# EAGLE design RGB_HDMI (EAGLE 6.6.0)
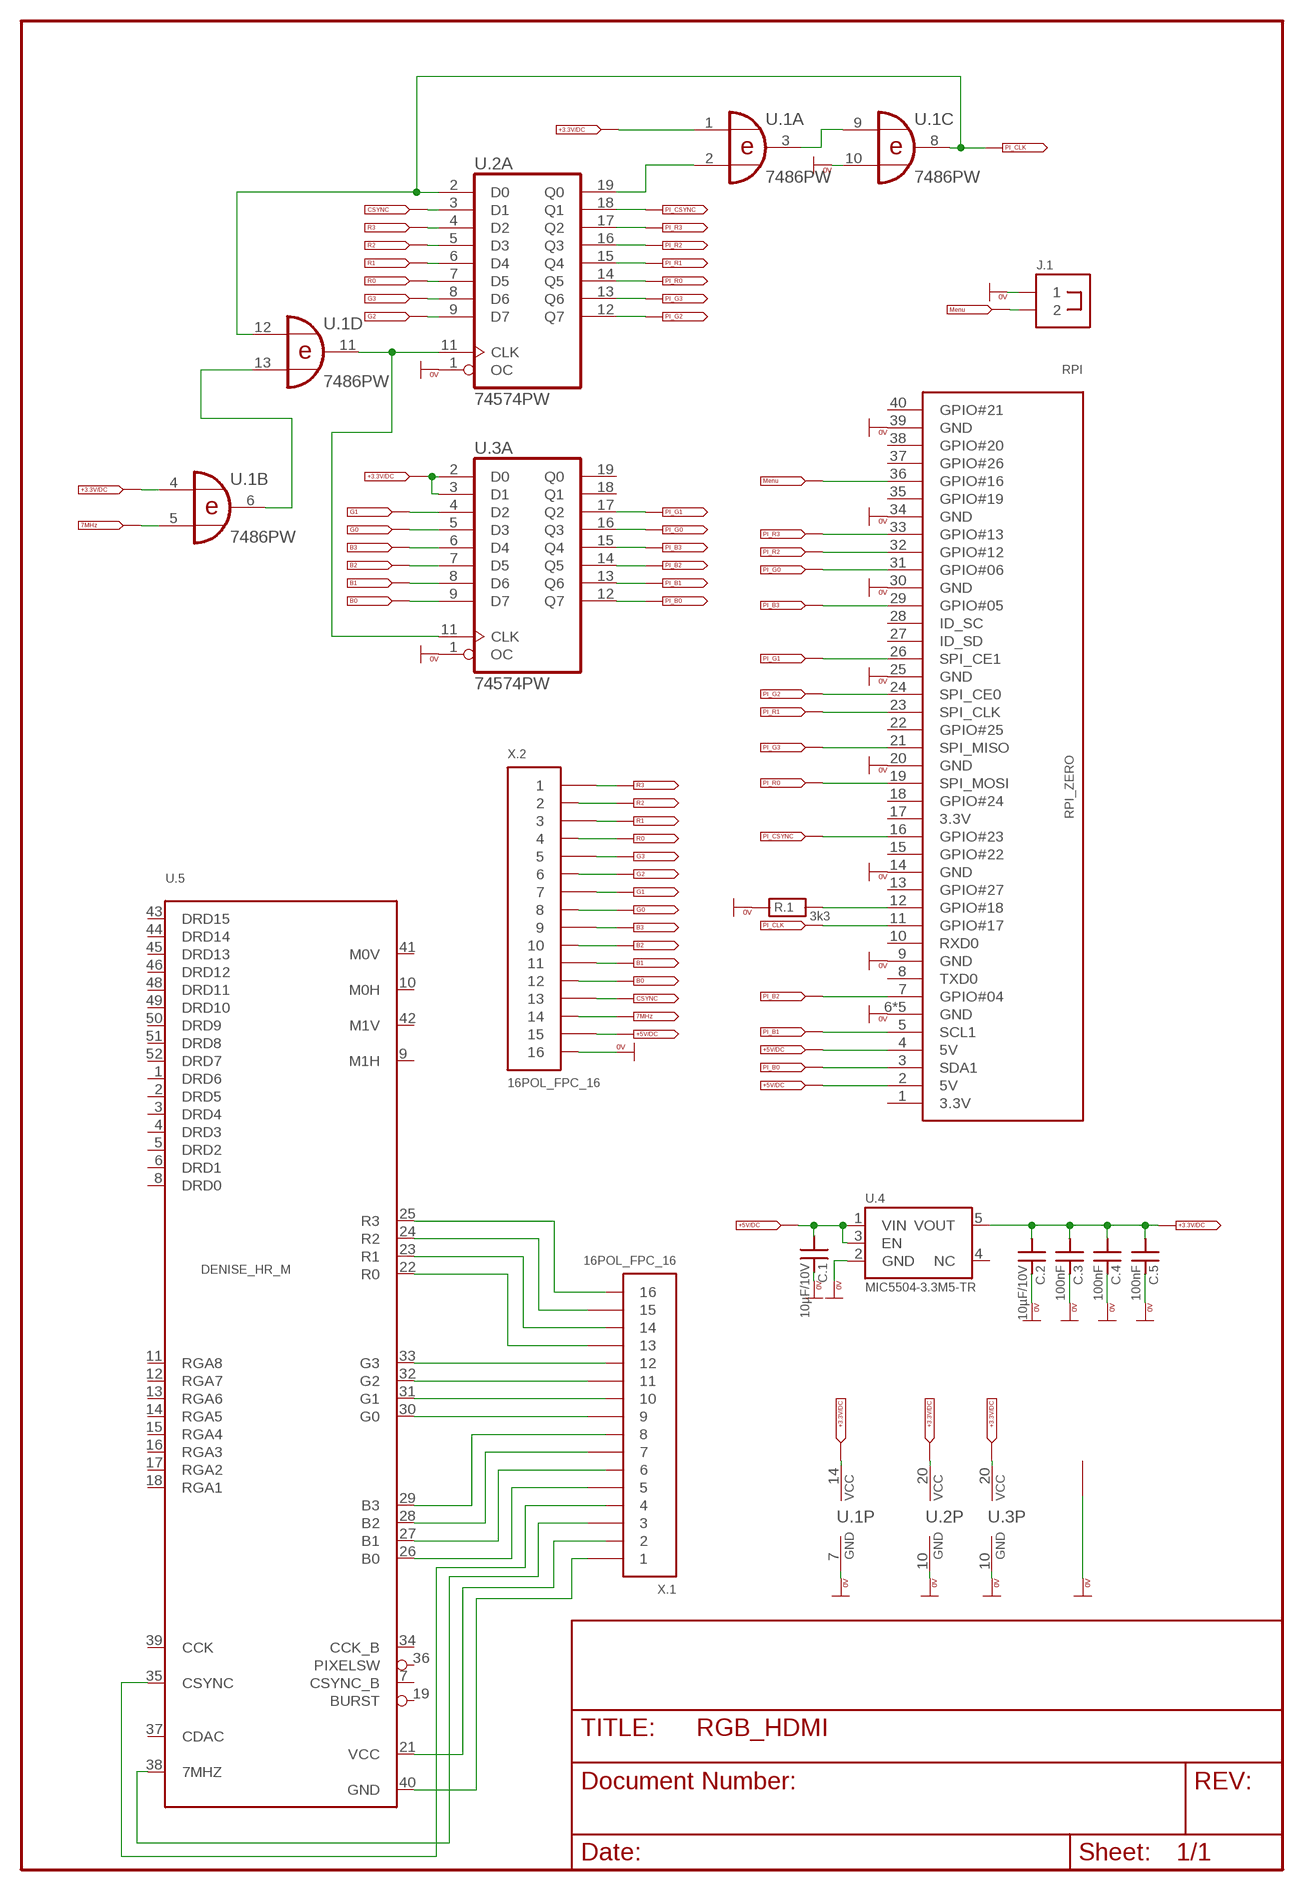
[diagram p0: schematic, sheet 1]

## Parts
C.1  10µF/10V  CAPACITOR_SMD_0805  [0805]
C.2  10µF/10V  CAPACITOR_SMD_0805  [0805]
C.3  100nF  CAPACITOR_SMD_0805  [0805]
C.4  100nF  CAPACITOR_SMD_0805  [0805]
C.5  100nF  CAPACITOR_SMD_0805  [0805]
J.1  2POLIG_1REIHIG  [2POLIG_1REIHIG]
K.1  PAD_1,0SQ  [1,0SQ]
R.1  3k3  RESISTOR_SMD_0805  [0805]
RPI  RPI_ZERO  [RPI_ZERO_FULL]
U.1  7486PW  [TSSOP14]
U.2  74574PW  [TSSOP20]
U.3  74574PW  [TSSOP20]
U.4  MIC5504-3.3M5-TR  TLV755P  [SOT23-5]
U.5  DENISE_HR_M  [PLCC_52_MIRROR]
X.1  16POL_FPC_16  [MOLEX_FPC_16]
X.2  16POL_FPC_16  [MOLEX_FPC_16]

## Nets
0V: C.1.2 C.2.2 C.3.2 C.4.2 C.5.2 J.1.1 K.1.P$1 R.1.1 RPI.6(GND) RPI.9(GND) RPI.14(GND) RPI.20(GND) RPI.25(GND) RPI.30(GND) RPI.34(GND) RPI.39(GND) RPI.P$1(GND) RPI.P$2(GND) RPI.P$3(GND) RPI.P$4(GND) U.1.7(P:GND) U.1.10(C:I1) U.2.1(A:OC) U.2.10(P:GND) U.3.1(A:OC) U.3.10(P:GND) U.4.2(GND) X.2.16
7MHZ: U.1.5(B:I1) X.2.14 ; supply symbol labelled 7MHz
+3.3V: C.2.1 C.3.1 C.4.1 C.5.1 U.1.1(A:I0) U.1.4(B:I0) U.1.14(P:VCC) U.2.20(P:VCC) U.3.2(A:D0) U.3.3(A:D1) U.3.20(P:VCC) U.4.5(VOUT) ; supply symbol labelled +3.3V-IN, +3.3V-OUT
+5V: C.1.1 RPI.2(5V) RPI.4(5V) U.4.1(VIN) U.4.3(EN) X.2.15 ; supply symbol labelled +5V-IN, +5V-OUT
B0: U.3.9(A:D7) X.2.12
B1: U.3.8(A:D6) X.2.11
B2: U.3.7(A:D5) X.2.10
B3: U.3.6(A:D4) X.2.9
CSYNC: U.2.3(A:D1) X.2.13
G0: U.3.5(A:D3) X.2.8
G1: U.3.4(A:D2) X.2.7
G2: U.2.9(A:D7) X.2.6
G3: U.2.8(A:D6) X.2.5
GND: U.5.40(GND) X.1.1
MENUE: J.1.2 RPI.36(GPIO#16) ; supply symbol labelled Menu
N$1: U.1.6(B:O) U.1.13(D:I1)
N$2: U.5.25(R3) X.1.16
N$3: U.5.24(R2) X.1.15
N$4: U.5.23(R1) X.1.14
N$5: U.5.22(R0) X.1.13
N$6: U.1.11(D:O) U.2.11(A:CLK) U.3.11(A:CLK)
N$7: U.1.2(A:I1) U.2.19(A:Q0)
N$8: U.1.3(A:O) U.1.9(C:I0)
N$9: U.5.30(G0) X.1.9
N$10: U.5.31(G1) X.1.10
N$11: U.5.32(G2) X.1.11
N$12: U.5.33(G3) X.1.12
N$13: U.5.29(B3) X.1.8
N$14: U.5.28(B2) X.1.7
N$15: U.5.27(B1) X.1.6
N$16: U.5.26(B0) X.1.5
N$18: U.5.21(VCC) X.1.2
N$19: U.5.38(7MHZ) X.1.3
N$20: U.5.35(CSYNC) X.1.4
N$37: R.1.2 RPI.12(GPIO#18)
PI_B0: RPI.3(SDA1) U.3.12(A:Q7)
PI_B1: RPI.5(SCL1) U.3.13(A:Q6)
PI_B2: RPI.7(GPIO#04) U.3.14(A:Q5)
PI_B3: RPI.29(GPIO#05) U.3.15(A:Q4)
PI_CLK: RPI.11(GPIO#17) U.1.8(C:O) U.1.12(D:I0) U.2.2(A:D0)
PI_CSYNC: RPI.16(GPIO#23) U.2.18(A:Q1)
PI_G0: RPI.31(GPIO#06) U.3.16(A:Q3)
PI_G1: RPI.26(SPI_CE1) U.3.17(A:Q2)
PI_G2: RPI.24(SPI_CE0) U.2.12(A:Q7)
PI_G3: RPI.21(SPI_MISO) U.2.13(A:Q6)
PI_R0: RPI.19(SPI_MOSI) U.2.14(A:Q5)
PI_R1: RPI.23(SPI_CLK) U.2.15(A:Q4)
PI_R2: RPI.32(GPIO#12) U.2.16(A:Q3)
PI_R3: RPI.33(GPIO#13) U.2.17(A:Q2)
R0: U.2.7(A:D5) X.2.4
R1: U.2.6(A:D4) X.2.3
R2: U.2.5(A:D3) X.2.2
R3: U.2.4(A:D2) X.2.1
Unconnected: RPI.1(3.3V) RPI.8(TXD0) RPI.10(RXD0) RPI.13(GPIO#27) RPI.15(GPIO#22) RPI.17(3.3V) RPI.18(GPIO#24) RPI.22(GPIO#25) RPI.27(ID_SD) RPI.28(ID_SC) RPI.35(GPIO#19) RPI.37(GPIO#26) RPI.38(GPIO#20) RPI.40(GPIO#21) U.3.18(A:Q1) U.3.19(A:Q0) U.4.4(NC) U.5.1(DRD6) U.5.2(DRD5) U.5.3(DRD4) U.5.4(DRD3) U.5.5(DRD2) U.5.6(DRD1) U.5.7(CSYNC_B) U.5.8(DRD0) U.5.9(M1H) U.5.10(M0H) U.5.11(RGA8) U.5.12(RGA7) U.5.13(RGA6) U.5.14(RGA5) U.5.15(RGA4) U.5.16(RGA3) U.5.17(RGA2) U.5.18(RGA1) U.5.19(BURST) U.5.34(CCK_B) U.5.36(PIXELSW) U.5.37(CDAC) U.5.39(CCK) U.5.41(M0V) U.5.42(M1V) U.5.43(DRD15) U.5.44(DRD14) U.5.45(DRD13) U.5.46(DRD12) U.5.48(DRD11) U.5.49(DRD10) U.5.50(DRD9) U.5.51(DRD8) U.5.52(DRD7)

## Library data of the parts
C.1-C.5 = de_discrete:CAPACITOR
J.1 = de_jumper:2POLIG
K.1 = de_loetauge:PAD
R.1 = de_discrete:RESISTOR
RPI = de_controller:RPI_ZERO
U.1 = de_logic:74*86: Quad 2-input EXCLUSIVE-OR (XOR) gate
U.2 U.3 = de_logic:74*574: 8-bit D type FLIP FLOP bus driver
U.4 = de_power:TLV755P
U.5 = Amiga:DENISE_HR
X.1 X.2 = de_connectors:16POL

## Board
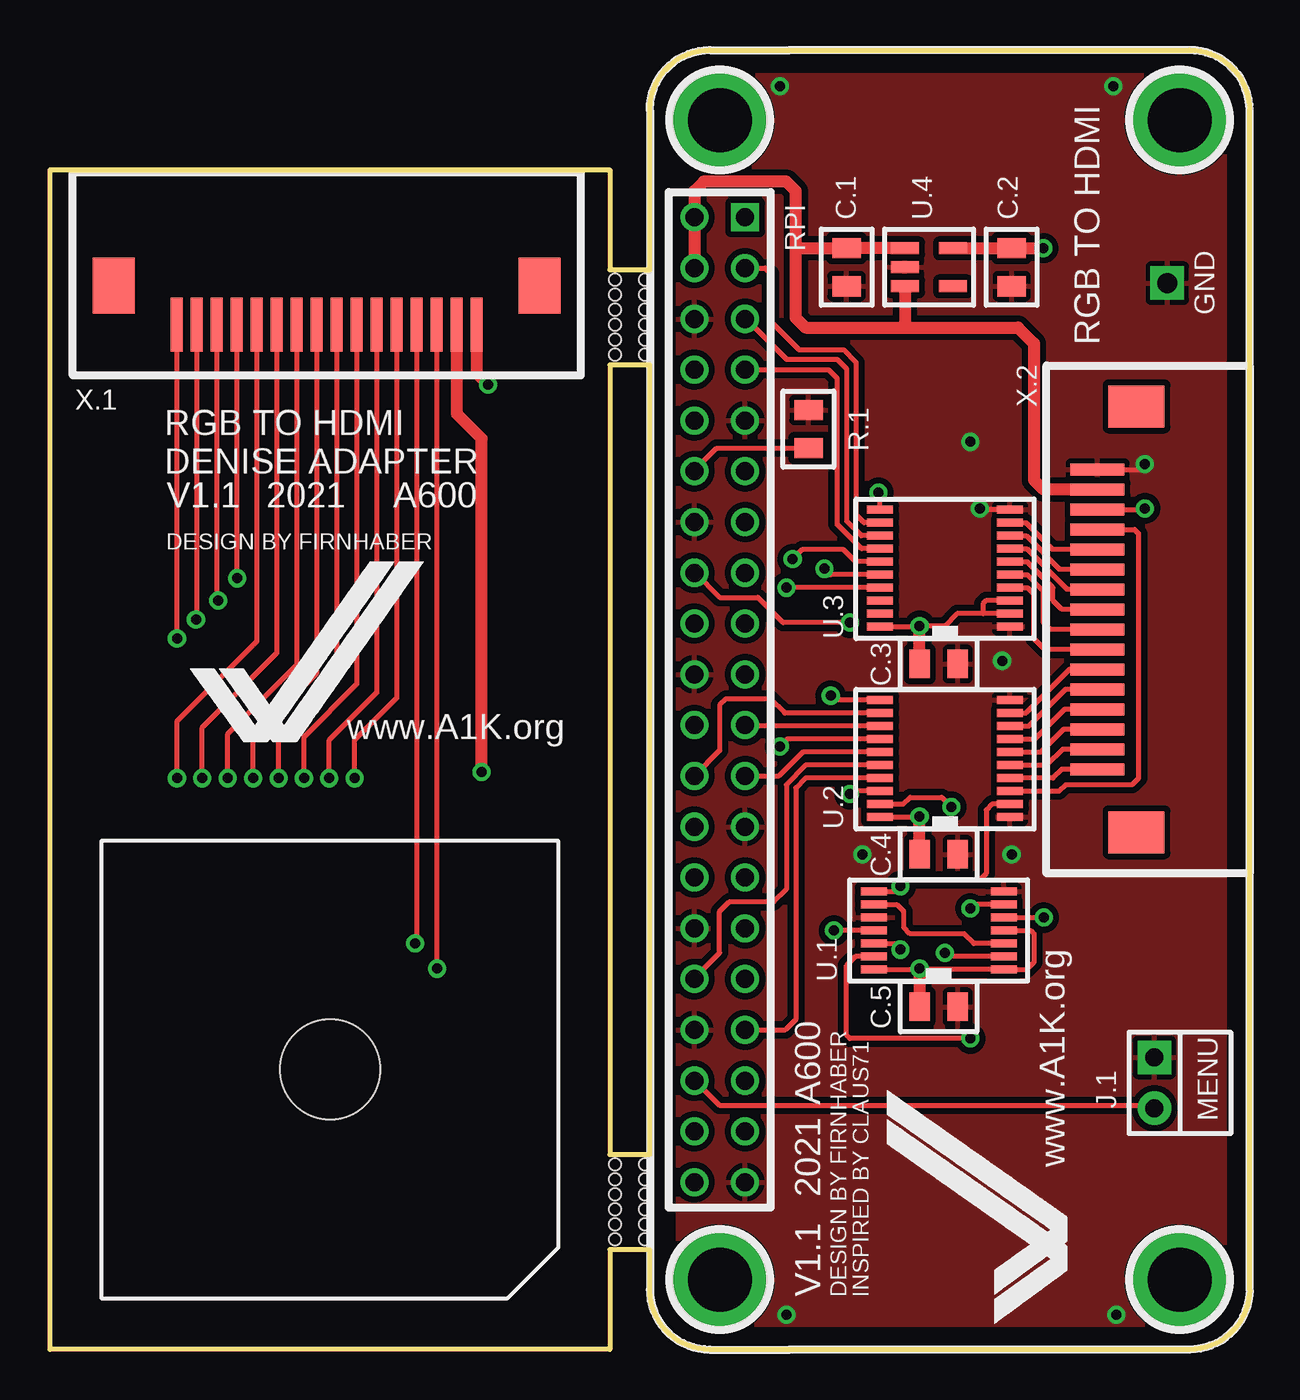
[diagram p1: board, top side]
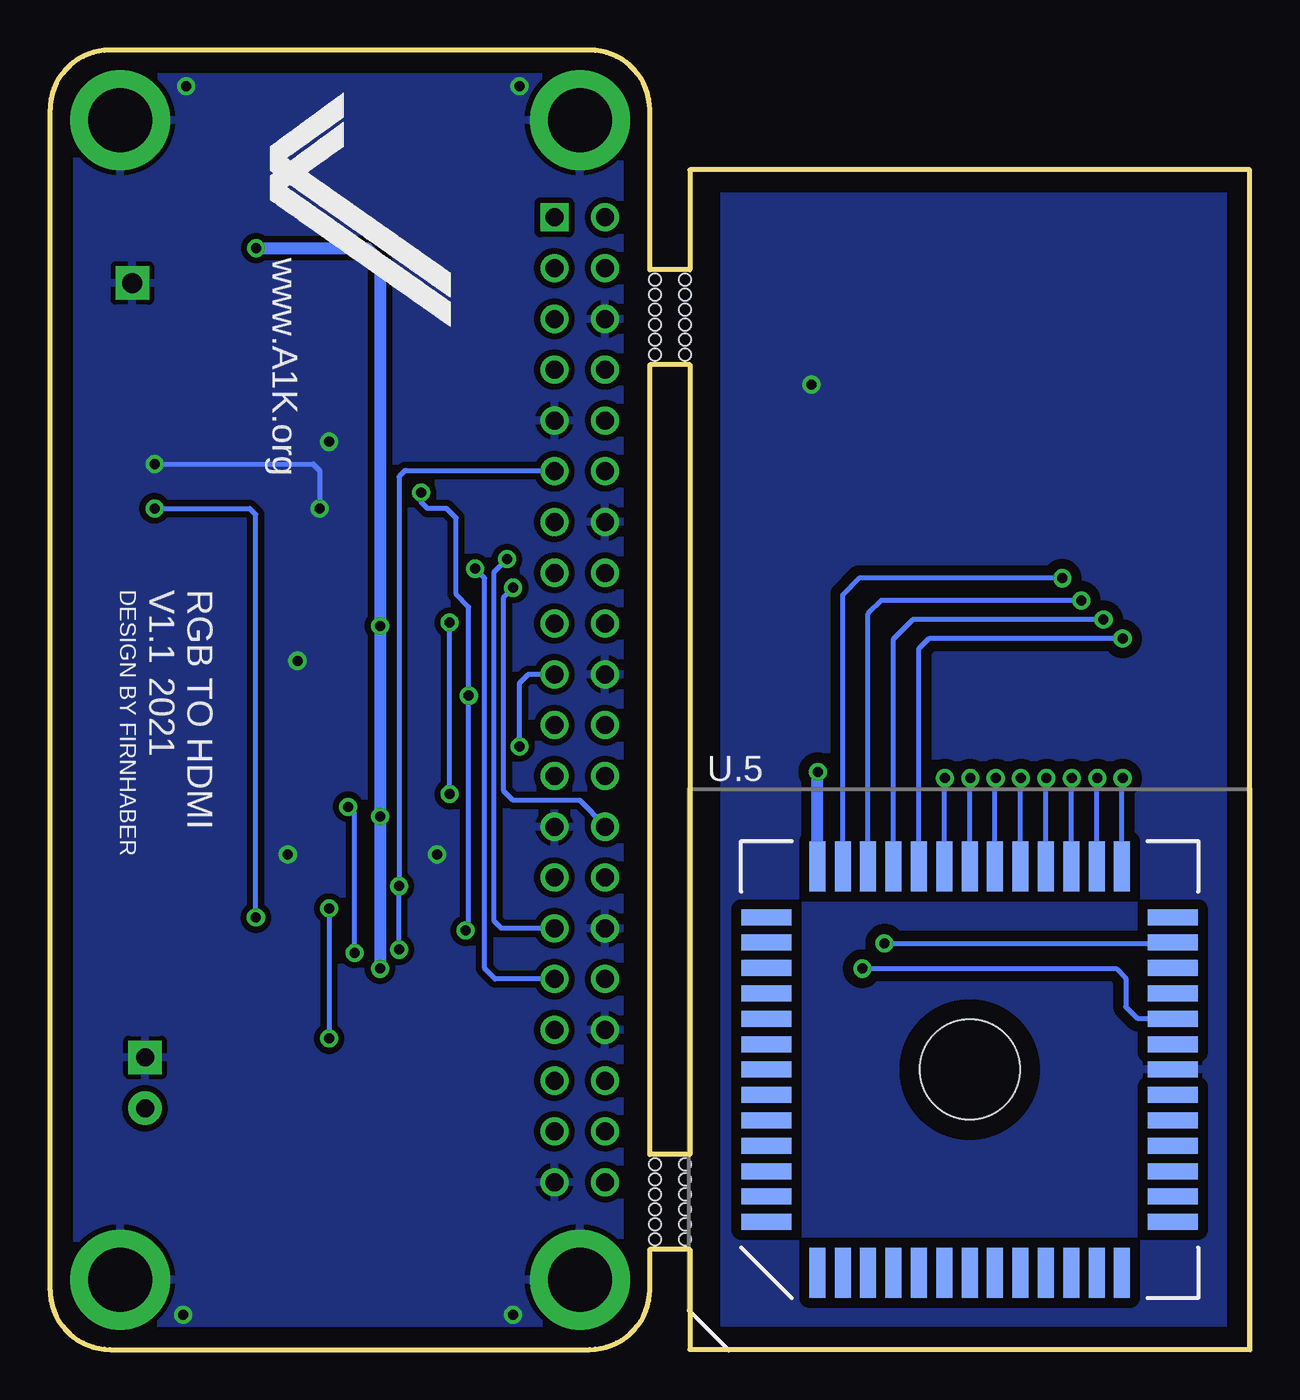
[diagram p2: board, bottom side, seen from below]

Size 60 x 65 mm. Coordinates in mm from the lower left corner, seen from the top.
Outline: 60,3 arc-90 57,0 33,0 arc-90 30,3
Outline: 30,62 arc-90 33,65 57,65 arc-90 60,62
Outline: 60,3 60,62
Outline: 30,3 30,5 28,5 28,0 0,0 0,59 28,59 28,54 30,54 30,62
Outline: 28,49.25 28,9.75 30,9.75 30,49.25 28,49.25
Copper layers (1*16): Top 0.035mm / dielectric 1.5mm / Bottom 0.035mm
Design rules "default *": minimum track width 10mil, minimum drill 24mil, track to track 5mil, track to pad 5mil, pad to pad 5mil, via to via 5mil, smd to smd 5mil, copper to edge 40mil, drill to drill 8mil, minimum pad ring 10mil, minimum via ring 8mil, stop-mask expansion 4mil, vias tented up to drill 30mil, thermal gap 10mil
Holes 5 mm at 14,14
Holes 0.6 mm at 28.25,53.5 28.25,52.75 28.25,52 28.25,51.25 28.25,50.5 28.25,49.75 29.75,53.5 29.75,52.75 29.75,52 29.75,51.25 29.75,50.5 29.75,49.75 28.25,5.5 28.25,6.25 28.25,7 28.25,7.75 28.25,8.5 28.25,9.25 29.75,9.25 29.75,8.5 29.75,7.75 29.75,7 29.75,6.25 29.75,5.5
tRestrict: area 28.5,0 to 31,64
bRestrict: area 27,0 to 29.5,59; area 28.5,0 to 31,64

### Footprints (pad centres in the part's own frame; a part is rotated, then mirrored left to right if it is on the bottom)
0805 = smd 1.016 x 1.422: 1 -0.953,0; 2 0.953,0
2POLIG_1REIHIG = drill 0.9 pad 1.676 square: 1 -1.27,0 | drill 0.9 pad 1.676: 2 1.27,0
1,0SQ = drill 1 pad 1.676 square: P$1 0,0
RPI_ZERO_FULL = drill 0.9 square: 1 2.23,8.37 | drill 0.9: 2 4.77,8.37; 3 2.23,10.91; 4 4.77,10.91; 5 2.23,13.45; 6 4.77,13.45; 7 2.23,15.99; 8 4.77,15.99; 9 2.23,18.53; 10 4.77,18.53; 11 2.23,21.07; 12 4.77,21.07; 13 2.23,23.61; 14 4.77,23.61; 15 2.23,26.15; 16 4.77,26.15; 17 2.23,28.69; 18 4.77,28.69; 19 2.23,31.23; 20 4.77,31.23; 21 2.23,33.77; 22 4.77,33.77; 23 2.23,36.31; 24 4.77,36.31; 25 2.23,38.85; 26 4.77,38.85; 27 2.23,41.39; 28 4.77,41.39; 29 2.23,43.93; 30 4.77,43.93; 31 2.23,46.47; 32 4.77,46.47; 33 2.23,49.01; 34 4.77,49.01; 35 2.23,51.55; 36 4.77,51.55; 37 2.23,54.09; 38 4.77,54.09; 39 2.23,56.63; 40 4.77,56.63 | drill 3.2 pad 5: P$1 -19.5,61.5; P$2 3.5,61.5; P$3 -19.5,3.5; P$4 3.5,3.5
TSSOP14 = smd 0.4 x 1.3: 1 -1.95,-3.25; 2 -1.3,-3.25; 3 -0.65,-3.25; 4 0,-3.25; 5 0.65,-3.25; 6 1.3,-3.25; 7 1.95,-3.25; 8 1.95,3.25; 9 1.3,3.25; 10 0.65,3.25; 11 0,3.25; 12 -0.65,3.25; 13 -1.3,3.25; 14 -1.95,3.25
TSSOP20 = smd 0.4 x 1.3: 1 -2.902,-3.25; 2 -2.252,-3.25; 3 -1.603,-3.25; 4 -0.953,-3.25; 5 -0.302,-3.25; 6 0.347,-3.25; 7 0.998,-3.25; 8 1.647,-3.25; 9 2.297,-3.25; 10 2.947,-3.25; 11 2.947,3.25; 12 2.297,3.25; 13 1.647,3.25; 14 0.998,3.25; 15 0.347,3.25; 16 -0.302,3.25; 17 -0.953,3.25; 18 -1.603,3.25; 19 -2.252,3.25; 20 -2.902,3.25
SOT23-5 = smd 0.6 x 1.4: 1 -0.95,-1.2; 2 -0.003,-1.2; 3 0.95,-1.2; 4 0.953,1.2; 5 -0.953,1.2
PLCC_52_MIRROR = smd 2.5 x 0.8: 1 10.16,0; 2 10.16,-1.27; 3 10.16,-2.54; 4 10.16,-3.81; 5 10.16,-5.08; 6 10.16,-6.35; 7 10.16,-7.62; 21 -10.16,-7.62; 22 -10.16,-6.35; 23 -10.16,-5.08; 24 -10.16,-3.81; 25 -10.16,-2.54; 26 -10.16,-1.27; 27 -10.16,0; 28 -10.16,1.27; 29 -10.16,2.54; 30 -10.16,3.81; 31 -10.16,5.08; 32 -10.16,6.35; 33 -10.16,7.62; 47 10.16,7.62; 48 10.16,6.35; 49 10.16,5.08; 50 10.16,3.81; 51 10.16,2.54; 52 10.16,1.27 | smd 0.8 x 2.5: 8 7.62,-10.16; 9 6.35,-10.16; 10 5.08,-10.16; 11 3.81,-10.16; 12 2.54,-10.16; 13 1.27,-10.16; 14 0,-10.16; 15 -1.27,-10.16; 16 -2.54,-10.16; 17 -3.81,-10.16; 18 -5.08,-10.16; 19 -6.35,-10.16; 20 -7.62,-10.16; 34 -7.62,10.16; 35 -6.35,10.16; 36 -5.08,10.16; 37 -3.81,10.16; 38 -2.54,10.16; 39 -1.27,10.16; 40 0,10.16; 41 1.27,10.16; 42 2.54,10.16; 43 3.81,10.16; 44 5.08,10.16; 45 6.35,10.16; 46 7.62,10.16
MOLEX_FPC_16 = smd 0.6 x 2.7: 1 -7.5,0; 2 -6.5,0; 3 -5.5,0; 4 -4.5,0; 5 -3.5,0; 6 -2.5,0; 7 -1.5,0; 8 -0.5,0; 9 0.5,0; 10 1.5,0; 11 2.5,0; 12 3.5,0; 13 4.5,0; 14 5.5,0; 15 6.5,0; 16 7.5,0 | smd 2.1 x 2.8: P$1 -10.65,-1.95; P$2 10.65,-1.95

### Placement (x,y rotation side)
C.1  39.85,54.13 270 top
C.2  48.1,54.13 270 top
C.3  44.45,34.29 0 top
C.4  44.45,24.77 0 top
C.5  44.45,17.15 0 top
J.1  55.24,13.34 270 top
K.1  55.88,53.34 0 top
R.1  37.94,46.04 270 top
RPI  37,65 180 top
U.1  44.45,20.96 90 top
U.2  44.77,29.53 90 top
U.3  44.77,39.05 90 top
U.4  43.97,54.13 270 top
U.5  14,14 270 bottom
X.1  13.84,51.26 180 top
X.2  52.39,36.51 90 top

### Tracks (layer width: path | path; a pad name or v marks a point on that pad's centre or on a via)
0V  (via drill 0.5)
  Top 0.254: X.2.16 54.49,44.01 v54.77,44.29 | U.3.10 46.58,42 v46.51,42.07 | 40.02,21.61 40.01,21.59
  Bottom 0.254: v54.77,44.29 46.83,44.29 46.51,43.97 v46.51,42.07
  other vias: 40.64,24.77 36.83,1.75 53.34,1.75 36.51,63.18 53.18,63.18 46.04,45.4 47.62,34.45 48.1,24.77
  pour Top (isolate 0.305): 30,0 30,65 60,65 60,0
  pour Bottom (isolate 0.305): 29.5,0 29.5,65 60,65 60,0
7MHZ  (via drill 0.5)
  Top 0.254: U.1.5 v49.7,21.61 | X.2.14 54.71,42.01 v54.77,42.07
  Bottom 0.254: v49.7,21.61 49.7,41.77 50.01,42.07 v54.77,42.07
+3.3V  (via drill 0.5)
  Top 0.254: U.2.20 43.45,26.63 v43.5,26.67 | U.1.14 43.45,19.01 v43.5,19.05 43.54,19.01 U.1.1 48.85,19.01 49.21,19.37 49.21,20.8 49.05,20.96 U.1.4 | U.3.2 46.67,36.8 | 46.67,36.8 45.37,36.8 44.77,36.2 v43.5,36.2 43.45,36.15 U.3.20 | U.3.3 46.82,37.45 46.67,37.31 46.67,36.8
  Top 0.61: U.4.5 C.2.1 v49.69,55.09 | v43.5,19.05 C.5.1 | C.4.1 v43.5,26.67 | C.3.1 v43.5,36.2
  Bottom 0.61: v49.69,55.09 44.13,55.09 43.5,54.45 v43.5,36.2 v43.5,26.67 v43.5,19.05
+5V
  Top 0.61: 37.31,55.09 37.31,51.59 37.78,51.12 42.86,51.12 | 37.31,55.09 C.1.1 U.4.1 | RPI.4 RPI.2 32.23,57.94 32.7,58.42 36.83,58.42 37.31,57.94 37.31,55.09 | 42.77,51.51 U.4.3 42.77,51.21 42.86,51.12 | 42.86,51.12 48.42,51.12 49.21,50.32 49.21,43.5 49.7,43.01 X.2.15
B0
  Top 0.254: U.3.9 48.82,41.35 50.16,40.01 X.2.12
B1
  Top 0.254: U.3.8 48.84,40.7 50.52,39.01 X.2.11
B2
  Top 0.254: U.3.7 48.85,40.05 50.89,38.01 X.2.10
B3
  Top 0.254: X.2.9 50.62,37.01 50.16,37.47 50.16,38.1 48.87,39.4 U.3.6
CSYNC
  Top 0.254: X.2.13 54.24,41.01 54.45,40.8 54.45,28.58 54.13,28.26 50.8,28.26 50.47,27.93 U.2.3
G0
  Top 0.254: X.2.8 50.03,36.01 49.69,36.35 49.69,37.94 48.88,38.75 U.3.5
G1
  Top 0.254: X.2.7 49.76,35.01 49.21,35.56 49.21,37.78 48.9,38.1 U.3.4
G2
  Top 0.254: U.2.9 48.81,31.83 51,34.01 X.2.6
G3
  Top 0.254: X.2.5 50.79,33.01 48.95,31.18 U.2.8
GND  (via drill 0.5)
  Top 0.61: X.1.1 21.34,48.83 v21.91,48.26
  pour Bottom (isolate 0.508): 0,0 0,59 28,59 28,0
MENUE
  Top 0.254: RPI.36 32.27,13.45 33.5,12.22 55.19,12.22 J.1.2
N$1  (via drill 0.5)
  Top 0.254: U.1.6 46.23,22.26 v46.04,22.07 | v46.04,15.56 40.01,15.56 39.85,15.72 39.85,19.21 40.29,19.66 U.1.13
  Bottom 0.254: v46.04,22.07 v46.04,15.56
N$2  (via drill 0.5)
  Top 0.254: X.1.16 6.34,35.87 v6.35,35.56
  Bottom 0.254: v6.35,35.56 16.03,35.56 16.54,35.05 U.5.25
N$3  (via drill 0.5)
  Top 0.254: X.1.15 7.34,36.55 v7.3,36.51
  Bottom 0.254: v7.3,36.51 16.83,36.51 17.81,35.53 U.5.24
N$4  (via drill 0.5)
  Top 0.254: X.1.14 8.34,37.54 v8.41,37.47
  Bottom 0.254: v8.41,37.47 18.41,37.47 19.08,36.8 U.5.23
N$5  (via drill 0.5)
  Top 0.254: X.1.13 9.34,38.6 v9.37,38.58
  Bottom 0.254: v9.37,38.58 19.53,38.58 20.35,37.75 U.5.22
N$6  (via drill 0.5)
  Top 0.254: U.1.11 v39.21,20.96 | U.2.11 39.28,32.48 v39.05,32.7 | U.3.11 41.52,42.78 v41.43,42.86
  Bottom 0.254: v39.21,20.96 39.05,21.11 v39.05,32.7 39.05,37.15 39.69,37.78 39.69,41.59 40.16,42.07 41.12,42.07 41.43,42.39 v41.43,42.86
N$7  (via drill 0.5)
  Top 0.254: U.1.2 44.96,19.66 v44.77,19.84 | U.2.19 42.67,27.28 43.02,27.62 44.61,27.62 v45.09,27.15
  Bottom 0.254: v44.77,19.84 44.77,26.83 v45.09,27.15
N$8
  Top 0.254: U.1.9 42.36,22.26 42.7,21.91 42.7,21.11 43.02,20.8 45.72,20.8 46.21,20.31 U.1.3
N$9  (via drill 0.5)
  Top 0.254: v10.16,28.58 10.16,30.64 13.34,33.82 X.1.9
  Bottom 0.254: U.5.30 10.19,28.55 v10.16,28.58
N$10  (via drill 0.5)
  Top 0.254: v8.89,28.58 8.89,30.8 12.34,34.25 X.1.10
  Bottom 0.254: U.5.31 8.92,28.55 v8.89,28.58
N$11  (via drill 0.5)
  Top 0.254: v7.62,28.58 7.62,31.12 11.34,34.84 X.1.11
  Bottom 0.254: U.5.32 7.65,28.55 v7.62,28.58
N$12  (via drill 0.5)
  Top 0.254: v6.35,28.58 6.35,31.43 10,35.08 10.16,35.24 10.34,35.42 X.1.12
  Bottom 0.254: U.5.33 6.38,28.55 v6.35,28.58
N$13  (via drill 0.5)
  Top 0.254: v11.43,28.58 11.43,30.64 14.34,33.55 X.1.8
  Bottom 0.254: U.5.29 11.46,28.55 v11.43,28.58
N$14  (via drill 0.5)
  Top 0.254: v12.7,28.58 12.7,30.64 15.34,33.28 X.1.7
  Bottom 0.254: U.5.28 12.73,28.55 v12.7,28.58
N$15  (via drill 0.5)
  Top 0.254: v13.97,28.58 13.97,30.48 16.34,32.85 X.1.6
  Bottom 0.254: U.5.27 14,28.55 v13.97,28.58
N$16  (via drill 0.5)
  Top 0.254: v15.24,28.58 15.24,30.48 17.34,32.58 X.1.5
  Bottom 0.254: U.5.26 15.27,28.55 v15.24,28.58
N$18  (via drill 0.5)
  Top 0.61: v21.59,28.89 21.59,45.56 20.34,46.81 X.1.2
  Bottom 0.61: U.5.21 21.62,28.86 v21.59,28.89
N$19  (via drill 0.5)
  Top 0.254: X.1.3 19.34,19.08 v19.37,19.05
  Bottom 0.254: v19.37,19.05 6.67,19.05 6.19,18.57 6.19,17.15 5.59,16.54 U.5.38
N$20  (via drill 0.5)
  Top 0.254: X.1.4 18.34,20.41 v18.26,20.32
  Bottom 0.254: v18.26,20.32 3.85,20.32 U.5.35
N$37
  Top 0.254: RPI.12 32.23,43.98 33.34,45.09 R.1.2
PI_B0
  Top 0.254: RPI.3 35.76,54.09 36.04,53.82 36.04,51.44 37.47,50.01 39.69,50.01 40.32,49.37 40.32,41.75 40.72,41.35 U.3.12
PI_B1
  Top 0.254: RPI.5 34.81,51.55 36.83,49.53 39.37,49.53 39.85,49.05 39.85,41.43 40.58,40.7 U.3.13
PI_B2
  Top 0.254: RPI.7 38.94,49.01 39.37,48.58 39.37,41.28 40.59,40.05 U.3.14
PI_B3  (via drill 0.5)
  Top 0.254: U.3.15 40.29,39.4 39.69,40.01 37.62,40.01 v37.15,39.53
  Bottom 0.254: RPI.29 37.42,21.07 37.78,21.43 37.78,38.89 v37.15,39.53
PI_CLK  (via drill 0.5)
  Top 0.254: U.2.2 47.12,27.28 46.83,26.99 46.83,23.81 46.51,23.5 42.86,23.5 v42.55,23.18 42.27,22.91 U.1.8 | U.1.12 42.24,20.31 v42.55,20
  Bottom 0.254: RPI.11 34.81,43.97 42.23,43.97 42.55,43.66 v42.55,23.18 v42.55,20
PI_CSYNC  (via drill 0.5)
  Top 0.254: RPI.16 32.27,38.85 33.5,37.62 35.4,37.62 36.67,36.35 v40.01,36.35 | U.2.18 40.15,27.93 v40.01,27.78
  Bottom 0.254: v40.01,27.78 v40.01,36.35
PI_G0  (via drill 0.5)
  Top 0.254: U.3.16 39.04,38.75 v38.73,39.05
  Bottom 0.254: RPI.31 37.74,18.53 38.26,19.05 38.26,38.58 v38.73,39.05
PI_G1  (via drill 0.5)
  Top 0.254: U.3.17 v36.83,38.1
  Bottom 0.254: RPI.26 32.23,26.2 33.5,27.46 36.83,27.46 37.31,27.94 37.31,37.62 v36.83,38.1
PI_G2
  Top 0.254: U.2.12 36.76,31.83 36.04,32.54 33.81,32.54 33.5,32.23 33.5,29.96 RPI.24
PI_G3
  Top 0.254: U.2.13 34.83,31.18 RPI.21
PI_R0  (via drill 0.5)
  Top 0.254: U.2.14 36.88,30.53 v36.51,30.16
  Bottom 0.254: v36.51,30.16 36.51,33.34 36.08,33.77 RPI.19
PI_R1
  Top 0.254: U.2.15 37.65,29.88 36.47,28.69 RPI.23
PI_R2
  Top 0.254: U.2.16 37.8,29.23 36.83,28.26 36.83,23.02 36.2,22.38 33.97,22.38 33.5,21.91 33.5,19.84 32.23,18.58 RPI.32
PI_R3
  Top 0.254: U.2.17 37.78,28.58 37.31,28.1 37.31,16.51 36.79,15.99 RPI.33
R0
  Top 0.254: X.2.4 50.74,32.01 49.26,30.53 U.2.7
R1
  Top 0.254: X.2.3 50.7,31.01 49.56,29.88 U.2.6
R2
  Top 0.254: X.2.2 50.65,30.01 49.86,29.23 U.2.5
R3
  Top 0.254: X.2.1 50.6,29.01 50.16,28.58 U.2.4

### Text on the board
tPlace: GND | RGB TO HDMI | RGB TO HDMI / DENISE ADAPTER | V1.1 | 2021 | A600 | DESIGN BY FIRNHABER | www.A1K.org | A600 | MENU | www.A1K.org | 2021 | V1.1 | DESIGN BY FIRNHABER | INSPIRED BY CLAUS71
bPlace: www.A1K.org | RGB TO HDMI | V1.1 | DESIGN BY FIRNHABER | 2021